# Altium schematic sheet ESP32_Module_Anchor.SchDoc
size A; SheetNumber: 2; SheetTotal: 4
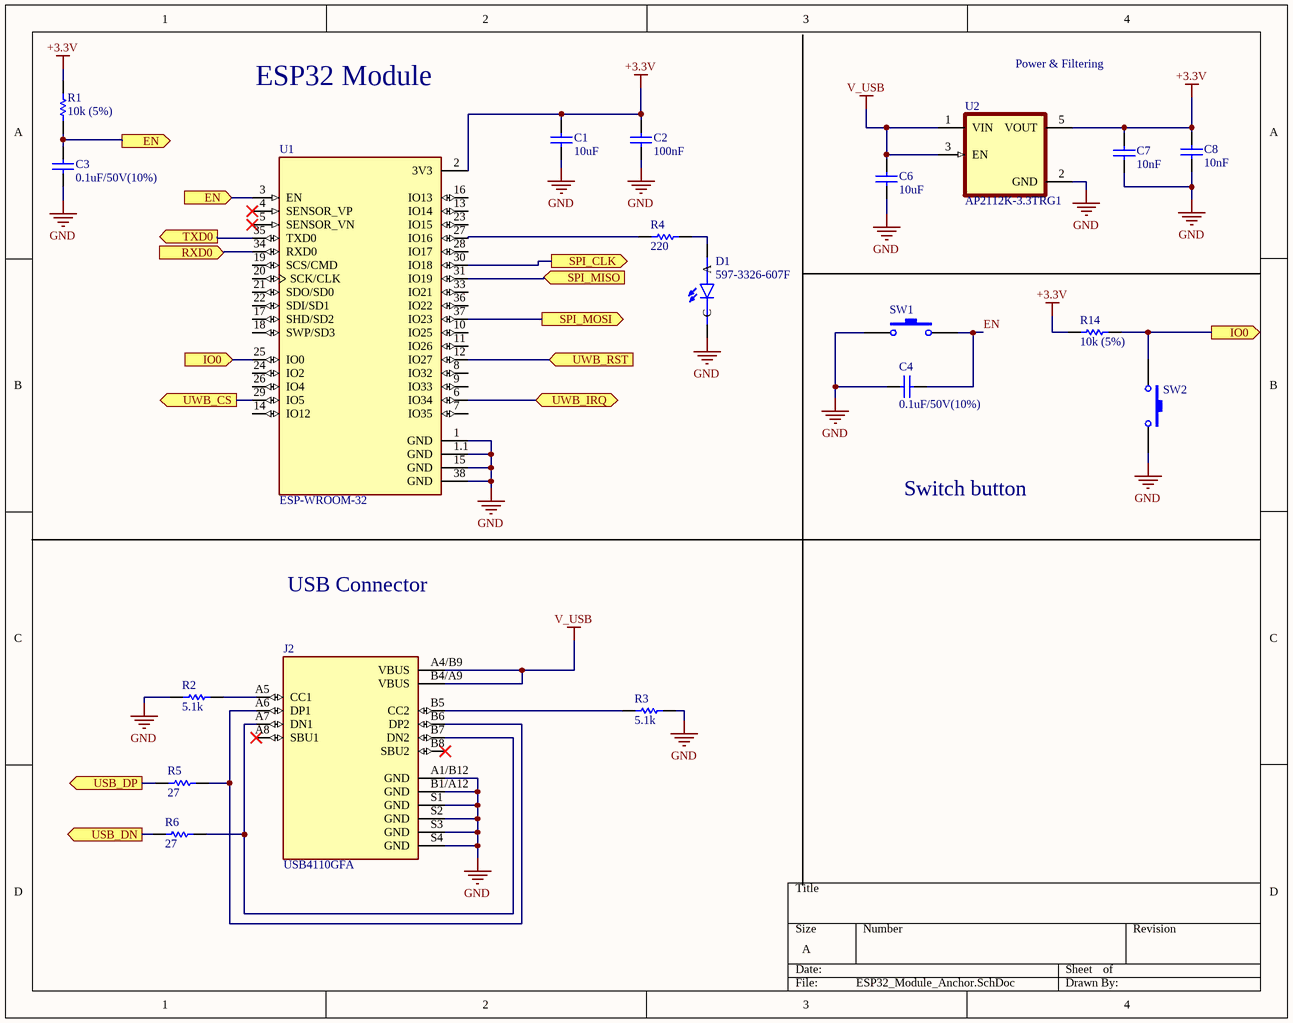
[diagram p0: ESP32_Module_Anchor.SchDoc]

## Parts
C1  value 10uF  [CAPC1608X90]  (hidden comment: Cap)
C2  value 100nF  [CAPC1005X55N]  (hidden comment: Cap)
C3  value 0.1uF/50V(10%)  [CAPC2012X94N]  (hidden comment: Cap)
C4  value 0.1uF/50V(10%)  [CAPC2012X94N]  (hidden comment: Cap)
C6  value 10uF  [CAPC1608X90]  (hidden comment: Cap)
C7  value 10nF  [CAPC1608X87N]  (hidden comment: Cap)
C8  value 10nF  [CAPC1608X87N]  (hidden comment: Cap)
D1  597-3326-607F  [LEDSC160X80X70L45N]
J2  USB4110GFA  [GCT_USB4110GFA]
R1  value 10k (5%)  [RESC1005X40]  (hidden comment: Res1)
R2  value 5.1k  [RESC1005X40]  (hidden comment: Res1)
R3  value 5.1k  [RESC1005X40]  (hidden comment: Res1)
R4  value 220  [RESC1005X40N]  (hidden comment: Res1)
R5  value 27  [RESC1608X60N]  (hidden comment: Res1)
R6  value 27  [RESC1608X60N]  (hidden comment: Res1)
R14  value 10k (5%)  [RESC1005X40]  (hidden comment: Res1)
SW1  SW-PB  [SW_TL3342F160QG]  (value not drawn)
SW2  SW-PB  [SW_TL3342F160QG]  (value not drawn)
U1  ESP-WROOM-32  [MODULE_ESP-WROOM-32]
U2  AP2112K-3.3TRG1  [SOT95P285X140-5N]

## Ports
EN (in), EN (out), IO0 (in), IO0 (out), RXD0 (in), SPI_CLK (out), SPI_MISO (in), SPI_MOSI (out), TXD0 (out), USB_DN (out), USB_DP (out), UWB_CS (out), UWB_IRQ (bidir), UWB_RST (in)

## Nets
+3.3V: C1.2 C2.2 C7.2 C8.2 R1.2 R14.2 U1.2(3V3) U2.5(VOUT)
GND: C1.1 C2.1 C3.1 C4.1 C6.1 C7.1 C8.1 D1.C J2.A1/B12(GND) J2.B1/A12(GND) J2.S1(GND) J2.S2(GND) J2.S3(GND) J2.S4(GND) R2.1 R3.2 SW1.1 SW2.2 U1.1(GND) U1.1.1(GND) U1.15(GND) U1.38(GND) U2.2(GND)
V_USB: C6.2 J2.A4/B9(VBUS) J2.B4/A9(VBUS) U2.1(VIN) U2.3(EN)
EN: C3.2 R1.1 U1.3(EN) ; port EN
EN: C4.2 SW1.2  [a separate net that carries the same name]
IO0: R14.1 SW2.1 U1.25(IO0) ; port IO0
RXD0: U1.34(RXD0) ; port RXD0
SPI_CLK: U1.30(IO18) ; port SPI_CLK
SPI_MISO: U1.31(IO19) ; port SPI_MISO
SPI_MOSI: U1.37(IO23) ; port SPI_MOSI
TXD0: U1.35(TXD0) ; port TXD0
USB_DN: R6.1 ; port USB_DN
USB_DP: R5.1 ; port USB_DP
UWB_CS: U1.29(IO5) ; port UWB_CS
UWB_IRQ: U1.6(IO34) ; port UWB_IRQ
UWB_RST: U1.12(IO27) ; port UWB_RST
NetD1_A: D1.A R4.2
NetJ2_A5: J2.A5(CC1) R2.2
NetJ2_A6: J2.A6(DP1) J2.B6(DP2) R5.2
NetJ2_A7: J2.A7(DN1) J2.B7(DN2) R6.2
NetJ2_B5: J2.B5(CC2) R3.1
NetR4_1: R4.1 U1.27(IO16)

Not connected (* = marked no-connect by the designer): J2 A8(SBU1)* B8(SBU2)*; U1 4(SENSOR_VP)* 5(SENSOR_VN)* 7(IO35) 8(IO32) 9(IO33) 10(IO25) 11(IO26) 13(IO14) 14(IO12) 16(IO13) 17(SHD/SD2) 18(SWP/SD3) 19(SCS/CMD) 20(SCK/CLK) 21(SDO/SD0) 22(SDI/SD1) 23(IO15) 24(IO2) 26(IO4) 28(IO17) 33(IO21) 36(IO22)

## Notes on the sheet
- ESP32 Module
- Power & Filtering
- Switch button
- USB Connector

## Library data of the parts
C1-C4 C6-C8 = Cap: Capacitor; Published: 8-Jun-2000; LatestRevisionDate: 17-Jul-2002; LatestRevisionNote: Re-released for DXP Platform.; PackageReference: RAD-0.3; Publisher: Altium Limited; PackageDescription: Radial Cap, Thru-Hole; 2 Leads; 0.3 in Pin Spacing
D1 = 597-3326-607F: SMD LED 0603 INGAN GREEN | Dialight 597-3326-607F; SnapEDA_Link: https://www.snapeda.com/parts/597-3326-607F/Dialight/view-part/?ref=snap; Package: 0603 Dialight; Value: *; MF: Dialight; MP: 597-3326-607F; Check_prices: https://www.snapeda.com/parts/597-3326-607F/Dialight/view-part/?ref=eda
J2 = USB4110GFA: USB-C (USB TYPE-C) USB 2.0 Receptacle Connector 24 (16+8 Dummy) Position Surface Mount, Right Angle; MF: Global Connector Technology; SnapEDA_Link: https://www.snapeda.com/parts/USB4110GFA/Global+Connector+Technology/view-part/?ref=snap; Package: None; Value: *; MP: USB4110GFA; Check_prices: https://www.snapeda.com/parts/USB4110GFA/Global+Connector+Technology/view-part/?ref=eda
R1-R6 R14 = Res1: Resistor; Published: 8-Jun-2000; LatestRevisionDate: 17-Jul-2002; LatestRevisionNote: Re-released for DXP Platform.; PackageReference: AXIAL-0.3; Publisher: Altium Limited; PackageDescription: Axial Device, Thru-Hole; 2 Leads; 0.3 in Pin Spacing
SW1 SW2 = SW-PB: Switch; Published: 24-Mar-1999; LatestRevisionDate: 17-Jul-2002; LatestRevisionNote: Re-released for DXP Platform.; PackageReference: SPST-2; Publisher: Altium Limited; PackageDescription: Switch; 2 Leads
U1 = ESP-WROOM-32: Transceptor serie ESP-WROOM-32; Placa de evaluaciÃ³n 802.11 b/g/n (Wi-Fi, WiFi, WLAN), BluetoothÂ® Smart 4.x de bajo consumo (BLE); MF: Espressif Systems; SnapEDA_Link: https://www.snapeda.com/parts/ESP-WROOM-32/Espressif+Systems/view-part/?ref=snap; Package: Module Espressif Systems; Value: *; MP: ESP-WROOM-32; Check_prices: https://www.snapeda.com/parts/ESP-WROOM-32/Espressif+Systems/view-part/?ref=eda
U2 = AP2112K-3.3TRG1: Linear Voltage Regulator IC Positive Fixed 1 Output 600mA SOT-25; MF: Diodes Inc.; Value: *; Purchase-URL: https://pricing.snapeda.com/search/part/AP2112K-3.3TRG1/?ref=eda; Package: SOT-753 Diodes Inc.; Availability: In Stock; Check_prices: https://www.snapeda.com/parts/AP2112K-3.3TRG1/Diodes+Inc./view-part/?ref=eda; Price: None; SnapEDA_Link: https://www.snapeda.com/parts/AP2112K-3.3TRG1/Diodes+Inc./view-part/?ref=snap; MP: AP2112K-3.3TRG1